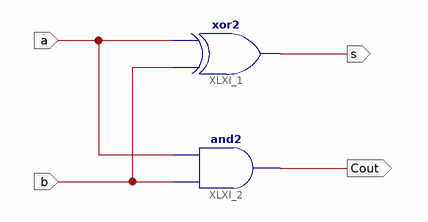
[diagram p0: schematic sheet 1]
// Xilinx ISE schematic HA.sch (spartan3e) as structural Verilog: 2 symbols, 4 ports
module HA (
  input  a,
  input  b,
  output s,
  output Cout
);

  xor XLXI_1 (s, b, a);
  and XLXI_2 (Cout, b, a);
endmodule
